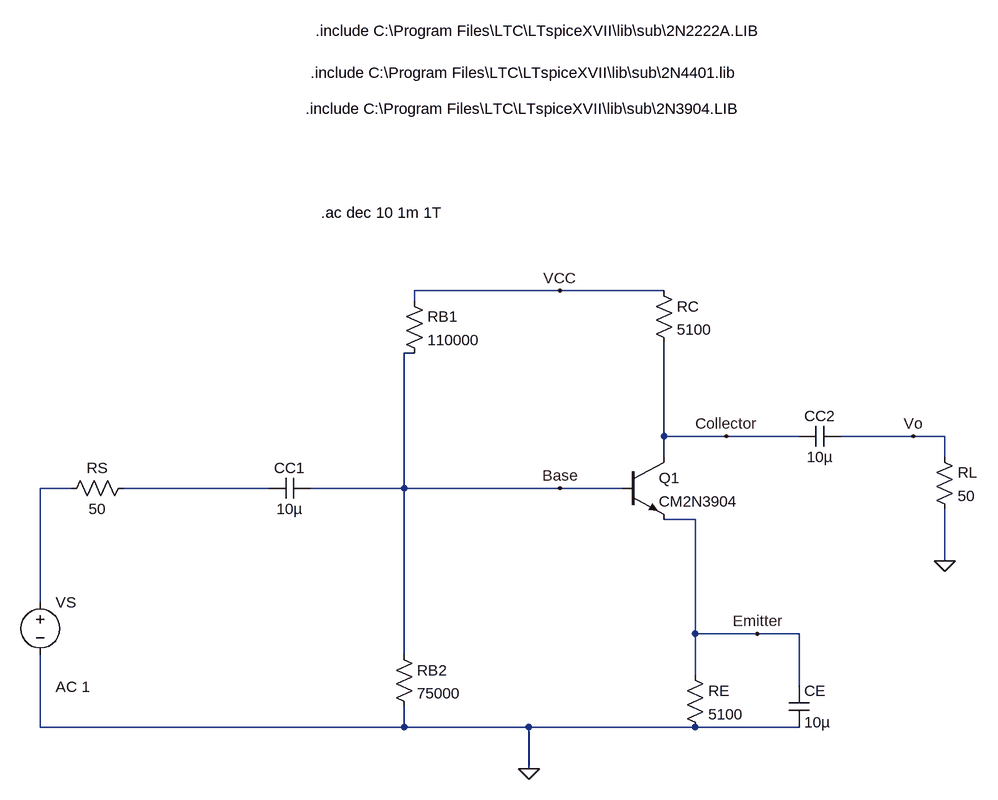
[diagram p0: schematic mp2 task2.asc]
mp2 task2.asc, the LTspice schematic file:
Version 4
SHEET 1 3216 804
WIRE 288 -16 64 -16
WIRE 448 -16 288 -16
WIRE 64 0 64 -16
WIRE 64 80 48 80
WIRE 448 208 448 64
WIRE 544 208 448 208
WIRE 656 208 544 208
WIRE 832 208 720 208
WIRE 880 208 832 208
WIRE 448 240 448 208
WIRE 880 240 880 208
WIRE -464 288 -512 288
WIRE -160 288 -384 288
WIRE 48 288 48 80
WIRE 48 288 -96 288
WIRE 288 288 48 288
WIRE 384 288 288 288
WIRE 496 336 448 336
WIRE 880 400 880 320
WIRE -512 464 -512 288
WIRE 496 512 496 336
WIRE 592 512 496 512
WIRE 656 512 592 512
WIRE 48 544 48 288
WIRE 496 576 496 512
WIRE 656 592 656 512
WIRE -512 656 -512 544
WIRE 48 656 48 624
WIRE 48 656 -512 656
WIRE 240 656 48 656
WIRE 496 656 240 656
WIRE 656 656 496 656
WIRE 240 720 240 656
FLAG 240 720 0
FLAG 288 -16 VCC
FLAG 592 512 Emitter
FLAG 880 400 0
FLAG 544 208 Collector
FLAG 288 288 Base
FLAG 832 208 Vo
SYMBOL res 48 -16 R0
SYMATTR InstName RB1
SYMATTR Value 110000
SYMBOL res 432 -32 R0
SYMATTR InstName RC
SYMATTR Value 5100
SYMBOL res 32 528 R0
SYMATTR InstName RB2
SYMATTR Value 75000
SYMBOL npn 384 240 R0
SYMATTR InstName Q1
SYMATTR Value CM2N3904
SYMBOL res 480 560 R0
SYMATTR InstName RE
SYMATTR Value 5100
SYMBOL cap -96 272 R90
WINDOW 0 0 32 VBottom 2
WINDOW 3 32 32 VTop 2
SYMATTR InstName CC1
SYMATTR Value 10µ
SYMBOL res -368 272 R90
WINDOW 0 0 56 VBottom 2
WINDOW 3 32 56 VTop 2
SYMATTR InstName RS
SYMATTR Value 50
SYMBOL cap 640 592 R0
SYMATTR InstName CE
SYMATTR Value 10µ
SYMBOL cap 720 192 R90
WINDOW 0 0 32 VBottom 2
WINDOW 3 32 32 VTop 2
SYMATTR InstName CC2
SYMATTR Value 10µ
SYMBOL res 864 224 R0
SYMATTR InstName RL
SYMATTR Value 50
SYMBOL voltage -512 448 R0
WINDOW 123 24 146 Left 2
WINDOW 39 0 0 Left 0
SYMATTR InstName VS
SYMATTR Value ""
SYMATTR Value2 AC 1
TEXT -104 -296 Left 2 !.include C:\\Program Files\\LTC\\LTspiceXVII\\lib\\sub\\2N3904.LIB
TEXT -96 -352 Left 2 !.include C:\\Program Files\\LTC\\LTspiceXVII\\lib\\sub\\2N4401.lib
TEXT -88 -416 Left 2 !.include C:\\Program Files\\LTC\\LTspiceXVII\\lib\\sub\\2N2222A.LIB
TEXT -80 -136 Left 2 !.ac dec 10 1m 1T

The netlist it stands for:
* mp2 task2.asc
RB1 VCC Base 110000
RC VCC Collector 5100
RB2 Base 0 75000
Q1 Collector Base Emitter 0 CM2N3904
RE Emitter 0 5100
CC1 Base N002 10µ
RS N002 N001 50
CE Emitter 0 10µ
CC2 Vo Collector 10µ
RL Vo 0 50
VS N001 0 AC 1
.model NPN NPN
.model PNP PNP
.lib standard.bjt
.include C:\Program Files\LTC\LTspiceXVII\lib\sub\2N3904.LIB
.include C:\Program Files\LTC\LTspiceXVII\lib\sub\2N4401.lib
.include C:\Program Files\LTC\LTspiceXVII\lib\sub\2N2222A.LIB
.ac dec 10 1m 1T
.backanno
.end

* Results of the author's LTspice run, read from the files saved beside the schematic
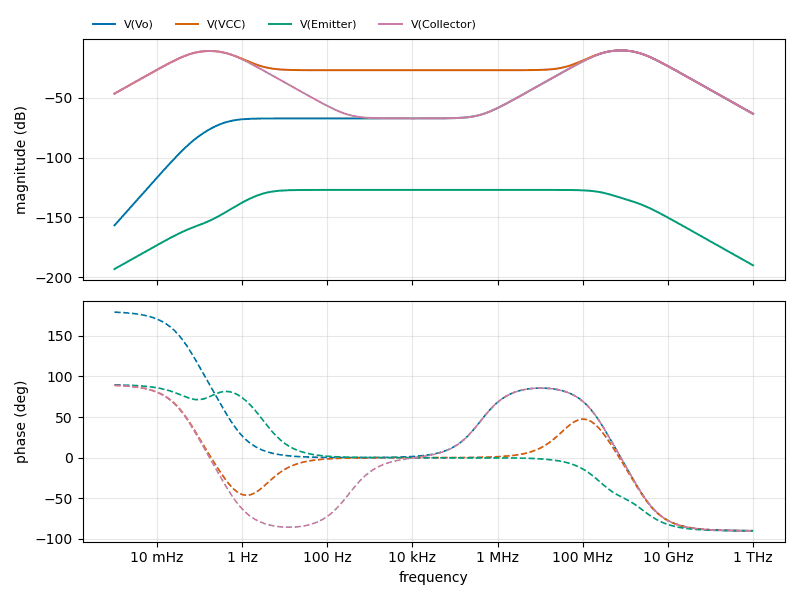
[diagram p1: AC Analysis of mp2 task2.asc, plotted from the saved traces]
* AC Analysis, 1 run:
*   V(Vo): -156.59 dB at 1 mHz, -63.41 dB at 1 THz, peak -10.46 dB at 794.3 MHz, 3 dB below the peak at 246.6 MHz and 2.496 GHz
*   V(VCC): -46.54 dB at 1 mHz, -63.40 dB at 1 THz, peak -10.43 dB at 794.3 MHz, 3 dB below the peak at 241.8 MHz and 2.49 GHz
*   V(Emitter): -193.04 dB at 1 mHz, -189.94 dB at 1 THz, peak -126.95 dB at 31.62 kHz, 3 dB below the peak at 3.145 Hz and 355.6 MHz
*   V(Collector): -46.54 dB at 1 mHz, -63.41 dB at 1 THz, peak -10.46 dB at 794.3 MHz, 3 dB below the peak at 246.6 MHz and 2.496 GHz